# Altium schematic sheet FlashMemorySchDoc.SchDoc
size A; SheetNumber: 10; SheetTotal: 13
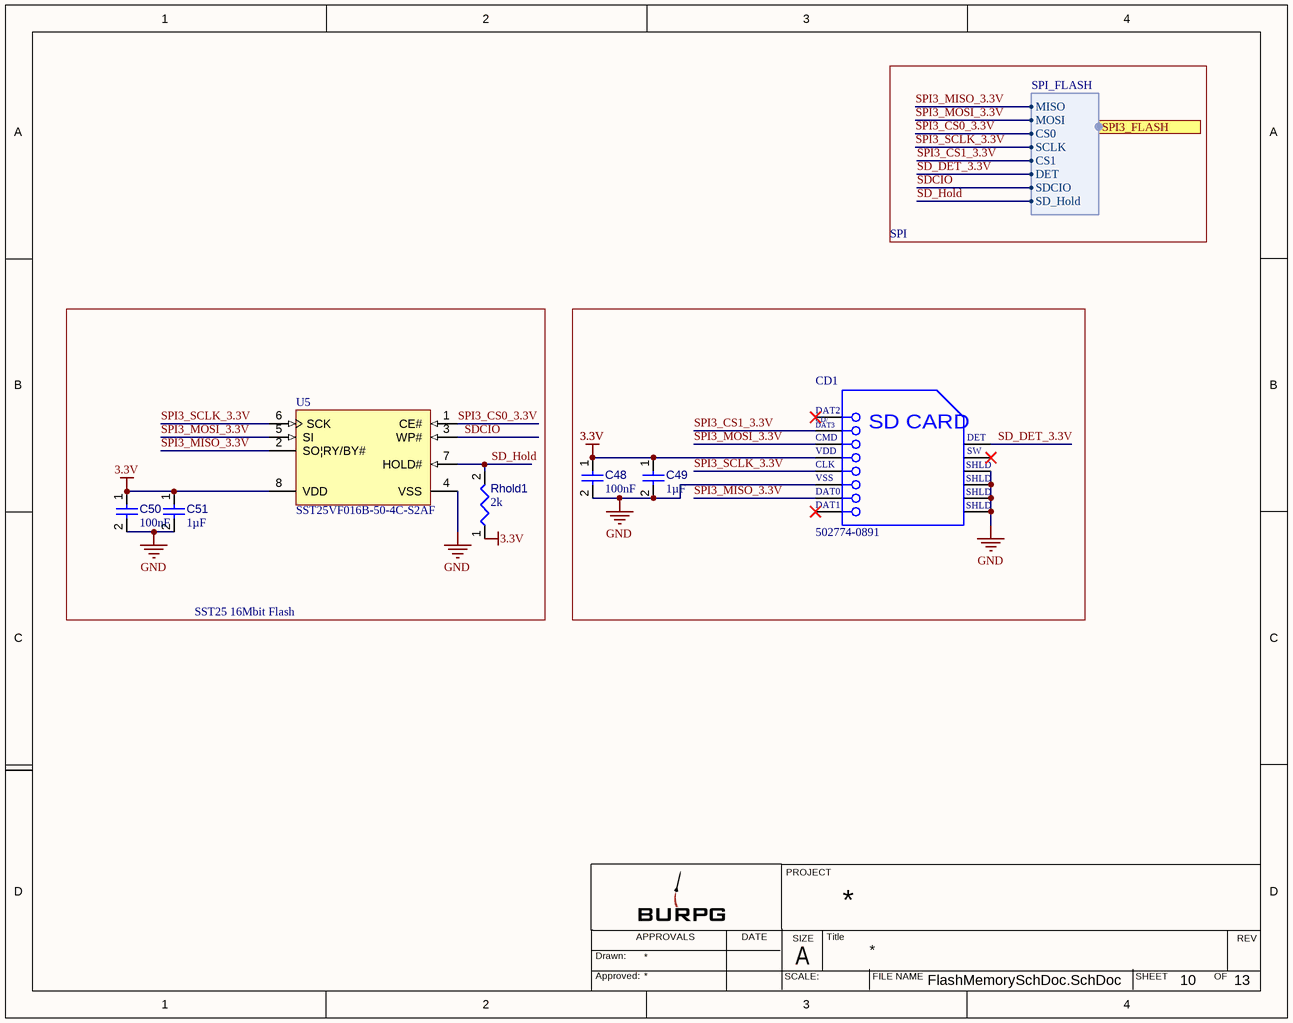
[diagram p0: FlashMemorySchDoc.SchDoc]

## Parts
C48  value 100nF  [CAPC0402(1005)60_L]  (hidden comment: Capacitor 100nF +/-20% 25V 0402)
C49  value 1µF  [CAPC1608X94X35NL15T15]  (hidden comment: Capacitor 1 uF +/- 10% 16 V 0603)
C50  value 100nF  [CAPC0402(1005)60_L]  (hidden comment: Capacitor 100nF +/-20% 25V 0402)
C51  value 1µF  [CAPC1608X94X35NL15T15]  (hidden comment: Capacitor 1 uF +/- 10% 16 V 0603)
CD1  502774-0891  [MOLX-502774-0891_V]
Rhold1  value 2k  [RESC0402(1005)_L]  (hidden comment: Resistor 2K +/-5 % 0402 63 mW)
U5  SST25VF016B-50-4C-S2AF  [MCHP-SOIC-S2A8_M]

## Blocks framed on the sheet
SST25 16Mbit Flash: C50 C51 Rhold1 U5

## Ports
SPI3_FLASH (harness SPI_FLASH)

## Harnesses
SPI_FLASH: MISO, MOSI, CS0, SCLK, CS1, DET, SDCIO, SD_Hold

## Nets
3.3V: C48.1 C49.1 C50.1 C51.1 CD1.4(VDD) Rhold1.1 U5.8(VDD)
GND: C48.2 C49.2 C50.2 C51.2 CD1.6(VSS) CD1.11(SHLD) CD1.12(SHLD) CD1.13(SHLD) CD1.14(SHLD) U5.4(VSS)
SD_DET_3.3V: CD1.9(DETECT) ; port SPI3_FLASH.DET
SD_Hold: Rhold1.2 U5.7(HOLD#) ; port SPI3_FLASH.SD_Hold
SDCIO: U5.3(WP#) ; port SPI3_FLASH.SDCIO
SPI3_CS0_3.3V: U5.1(CE#) ; port SPI3_FLASH.CS0
SPI3_CS1_3.3V: CD1.2(CD/DAT3) ; port SPI3_FLASH.CS1
SPI3_MISO_3.3V: CD1.7(DAT0) U5.2(SO|RY/BY#) ; port SPI3_FLASH.MISO
SPI3_MOSI_3.3V: CD1.3(CMD) U5.5(SI) ; port SPI3_FLASH.MOSI
SPI3_SCLK_3.3V: CD1.5(CLK) U5.6(SCK) ; port SPI3_FLASH.SCLK

Not connected (* = marked no-connect by the designer): CD1 1(DAT2)* 8(DAT1)* 10(SWITCH)*

## Notes on the sheet
- SPI
- PROJECT
- Drawn:
- Approved:
- APPROVALS
- DATE
- SCALE:
- SIZE
- A
- Title
- FILE NAME
- SHEET
- OF
- REV
- (in symbol CMP-2000-05248-1) CD/; DAT3; SD CARD; DET; SW

## Library data of the parts
C48 C50 = CMP-001-00065-4: Chip Capacitor, 100nF +/-20%, 25V, 0402, Thickness 0.6 mm; Tolerance: 10%; Max Operating Temperature: 85°C; Min Operating Temperature: -55°C; Pins: 2; Voltage Rating: 25V; Mounting Technology: SMT; Case/Package: 0402
C49 C51 = CMP-001-00003-6: Chip Capacitor, 1 uF, +/- 10%, 16 V, 0603 (1608 Metric); Voltage Rating: 16V; Capacitor Type: Ceramic; Max Operating Temperature: 125°C; Pins: 2; Tolerance: 10%; Min Operating Temperature: -55°C; RoHS Compliant: True; Mounting Technology: SM; Case/Package: 0603
CD1 = CMP-2000-05248-1: Micro SD Memory Card Connector, 0.5 A, 10 V (DC), -25 to 85 degC, 8-Pin SMT, RoHS, Tape and Reel; Manufacturer: Molex; 3D Model: 502774-0891.stp; Online Catalog: microSD™Series; Number of Positions: 10(8+2); Card Type: SecureDigital-microSD™; Insertion, Removal Method: PushIn,PushOut; Other Names: WM24066DKR; Connector Type: ConnectorandEjector; Features: Switch; Family: MemoryConnectors-PCCardSockets; Manufacturer URL: http://www.molex.com/; Mounting Type: SurfaceMount,RightAngle; Contact Finish Thickness: 20µin(0.51µm); Standard Package: 1; Series: 502774; Ejector Side: -; Datasheet Version: Rev. D, 04/2004; Category: Connectors,Interconnects; Contact Finish: Gold; Datasheet URL: https://datasheet.ciiva.com/1104/1499551-1104671.pdf; RoHS Information: 502774-0891CertofCompliance; Mounting Feature: Reverse-Bottom; Packaging: Digi-Reel; Height Above Board: 0.071"(1.80mm); Catalog Drawings: 502774-0891
Rhold1 = CMP-009-00138-3: Chip Resistor, 2 kOhms, +/-5 %, 63 mW, -55 to 155 degC, 0402; Tolerance: 5%; Power: 63mW; Max Operating Temperature: 155°C; Pins: 2; Min Operating Temperature: -55°C; Case/Package: 0402
U5 = CMP-0378-00041-1: 16 Mbit SPI Serial Flash, 2.7 to 3.6 V, 50 MHz, 0 to 70 degC, 8-pin SOIC (S2A8), Tube; Manufacturer: Microchip; PackageReference: SOIC-S2A8; PackageVersion: Rev. A; ComponentLink3URL: http://ww1.microchip.com/downloads/en/DeviceDoc/25051A.pdf; ComponentLink1Description: Manufacturer URL; ComponentLink4URL: http://www.microchip.com/SST25VF016B; ComponentLink1URL: http://www.microchip.com; DatasheetVersion: Rev. A; ComponentLink2URL: http://ww1.microchip.com/downloads/en/DeviceDoc/25044A.pdf; PackageDescription: 8-Lead Plastic Small Outline Intergrated Circuit, 5.275 x 5.275 mm Body, 1.27 mm Pitch; PartNumber: SST25VF016B-50-4C-S2AF; ComponentLink3Description: Package Specification; ComponentLink2Description: Datasheet; Mounting Technology: Surface Mount; ComponentLink4Description: Product URL